# Altium schematic sheet AC_Current_Voltage_Measurement.SchDoc: Current - Voltage Measurement
size A4; CompanyName: -; DrawnBy: Naldi, López; Revision: 1; SheetNumber: 4; SheetTotal: 4; Number: 25
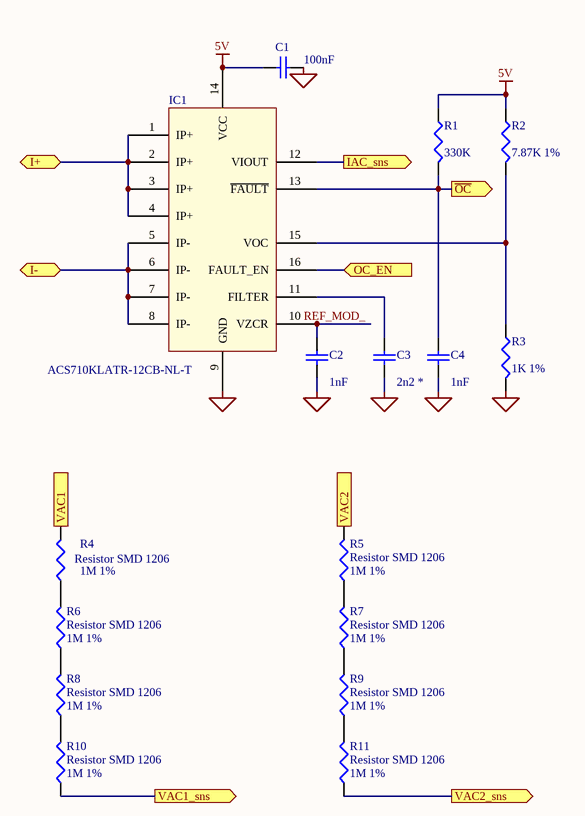
[diagram p0: AC_Current_Voltage_Measurement.SchDoc]

## Parts
C1  value 100nF  [Chip2PinSM127P600-8N]  (hidden comment: EPCOS C2012X7R1H104K)
C2  value 1nF  [Chip2PinSM127P600-8N]  (hidden comment: EPCOS B37940K51102J60)
C3  value 2n2 *  [Chip2PinSM127P600-8N]  (hidden comment: EPCOS B37940)
C4  value 1nF  [Chip2PinSM127P600-8N]  (hidden comment: EPCOS B37940K51102J60)
IC1  ACS710KLATR-12CB-NL-T  [AC710 - SOIC127P600-8N]
R1  value 330K  [Chip2PinSM127P600-8N - 0805]  (hidden comment: Resistor SMD 0805)
R2  value 7.87K 1%  [Chip2PinSM127P600-8N - 0805]  (hidden comment: Resistor SMD 0805)
R3  value 1K 1%  [Chip2PinSM127P600-8N - 0805]  (hidden comment: Resistor SMD 0805)
R4  Resistor SMD 1206  value 1M 1%  [RESC3116X07N - 1206]
R5  Resistor SMD 1206  value 1M 1%  [RESC3116X07N - 1206]
R6  Resistor SMD 1206  value 1M 1%  [RESC3116X07N - 1206]
R7  Resistor SMD 1206  value 1M 1%  [RESC3116X07N - 1206]
R8  Resistor SMD 1206  value 1M 1%  [RESC3116X07N - 1206]
R9  Resistor SMD 1206  value 1M 1%  [RESC3116X07N - 1206]
R10  Resistor SMD 1206  value 1M 1%  [RESC3116X07N - 1206]
R11  Resistor SMD 1206  value 1M 1%  [RESC3116X07N - 1206]

## Ports
I+ (bidir), I- (bidir), IAC_sns (out), OC_EN (in), VAC1 (in), VAC1_sns (out), VAC2 (in), VAC2_sns (out), ~{OC} (out)

## Nets
5V: C1.1 IC1.14(VCC) R1.1 R2.1
SGND: C1.2 C2.1 C3.1 C4.1 IC1.9(GND) R3.2
I+: IC1.1(IP+) IC1.2(IP+) IC1.3(IP+) IC1.4(IP+) ; port I+
I-: IC1.5(IP-) IC1.6(IP-) IC1.7(IP-) IC1.8(IP-) ; port I-
IAC_sns: IC1.12(VIOUT) ; port IAC_sns
~{OC}: C4.2 IC1.13(~{FAULT}) R1.2 ; port ~{OC}
OC_EN: IC1.16(FAULT_EN) ; port OC_EN
VAC1: R4.2 ; port VAC1
VAC1_sns: R10.1 ; port VAC1_sns
VAC2: R5.2 ; port VAC2
VAC2_sns: R11.1 ; port VAC2_sns
NetC2_2: C2.2 IC1.10(VZCR)
NetC3_2: C3.2 IC1.11(FILTER)
NetIC1_15: IC1.15(VOC) R2.2 R3.1
NetR4_1: R4.1 R6.2
NetR5_1: R5.1 R7.2
NetR6_1: R6.1 R8.2
NetR7_1: R7.1 R9.2
NetR8_1: R8.1 R10.2
NetR9_1: R9.1 R11.2

## Notes on the sheet
- Labels drawn without touching a wire or pin: REF_MOD_
- Title
- Size:
- Project:
- A4
- Number:
- Revision:
- Sheet
- of
- Drawn by:
- Company:
- File:

## Library data of the parts
C1 = EPCOS C2012X7R1H104K: Ceramic Multilayer 100nF 50Vdc; Published: 8-Jun-2000; LatestRevisionDate: 17-Jul-2002; LatestRevisionNote: Re-released for DXP Platform.; PackageReference: RAD-0.3; Publisher: Altium Limited; PackageDescription: Radial Cap, Thru-Hole; 2 Leads; 0.3 in Pin Spacing
C2 C4 = EPCOS B37940K51102J60: Ceramic Multilayer 1nF 50Vdc COG; Published: 8-Jun-2000; LatestRevisionDate: 17-Jul-2002; LatestRevisionNote: Re-released for DXP Platform.; PackageReference: RAD-0.3; Publisher: Altium Limited; PackageDescription: Radial Cap, Thru-Hole; 2 Leads; 0.3 in Pin Spacing
C3 = EPCOS B37940K51102J60: Ceramic Multilayer 50Vdc COG; Published: 8-Jun-2000; LatestRevisionDate: 17-Jul-2002; LatestRevisionNote: Re-released for DXP Platform.; PackageReference: RAD-0.3; Publisher: Altium Limited; PackageDescription: Radial Cap, Thru-Hole; 2 Leads; 0.3 in Pin Spacing
IC1 = ACS710: Hall Effect Current Sensor
R1-R3 = Resistor SMD 0805: Published: 8-Jun-2000; LatestRevisionDate: 29-May-2009; LatestRevisionNote: IPC-7351 Footprint Added.; PackageReference: J1-0603; Publisher: Altium Limited; PackageDescription: Chip Resistor
R4-R11 = Resistor SMD 1206: Published: 8-Jun-2000; LatestRevisionDate: 29-May-2009; LatestRevisionNote: IPC-7351 Footprint Added.; PackageReference: J1-0603; Publisher: Altium Limited; PackageDescription: Chip Resistor